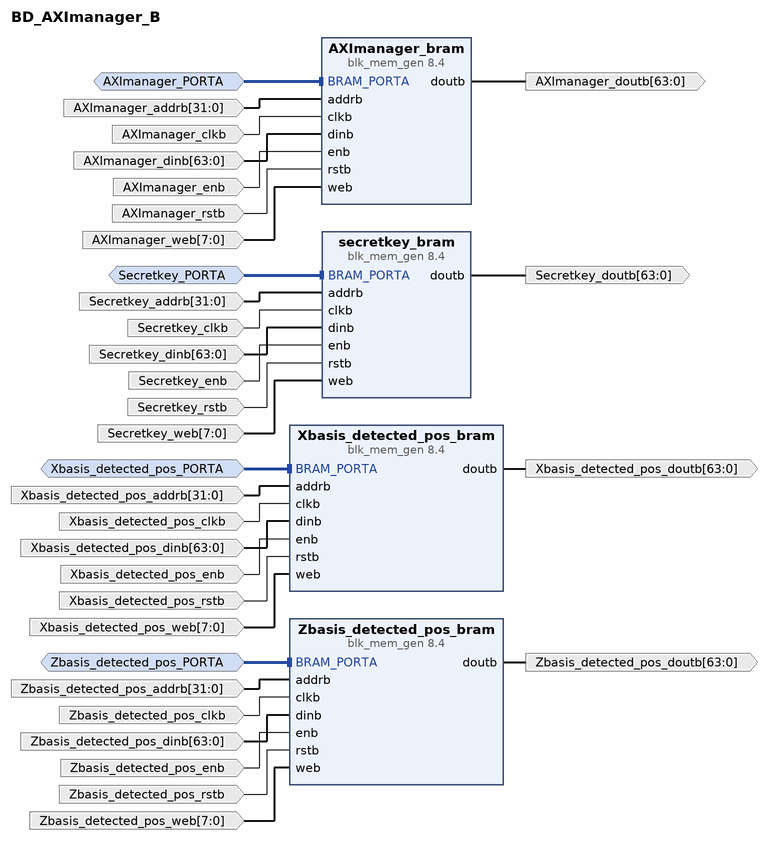
[diagram p0: block diagram of the top level]
# Vivado block design BD_AXImanager_B, xcku5p-ffvb676-2-e, Vivado 2022.1
create_bd_design BD_AXImanager_B

create_bd_intf_port -mode Slave -vlnv xilinx.com:interface:bram_rtl:1.0 AXImanager_PORTA
set_property -dict [list \
  CONFIG.MASTER_TYPE BRAM_CTRL \
  CONFIG.MEM_SIZE 4096 \
  CONFIG.MEM_WIDTH 64 \
  CONFIG.READ_WRITE_MODE READ_WRITE \
] [get_bd_intf_ports AXImanager_PORTA]
create_bd_intf_port -mode Slave -vlnv xilinx.com:interface:bram_rtl:1.0 Secretkey_PORTA
set_property -dict [list \
  CONFIG.MASTER_TYPE BRAM_CTRL \
  CONFIG.MEM_SIZE 262144 \
  CONFIG.MEM_WIDTH 64 \
  CONFIG.READ_WRITE_MODE READ_WRITE \
] [get_bd_intf_ports Secretkey_PORTA]
create_bd_intf_port -mode Slave -vlnv xilinx.com:interface:bram_rtl:1.0 Xbasis_detected_pos_PORTA
set_property -dict [list \
  CONFIG.MASTER_TYPE BRAM_CTRL \
  CONFIG.MEM_SIZE 262144 \
  CONFIG.MEM_WIDTH 64 \
  CONFIG.READ_WRITE_MODE READ_WRITE \
] [get_bd_intf_ports Xbasis_detected_pos_PORTA]
create_bd_intf_port -mode Slave -vlnv xilinx.com:interface:bram_rtl:1.0 Zbasis_detected_pos_PORTA
set_property -dict [list \
  CONFIG.MASTER_TYPE BRAM_CTRL \
  CONFIG.MEM_SIZE 262144 \
  CONFIG.MEM_WIDTH 64 \
  CONFIG.READ_WRITE_MODE READ_WRITE \
] [get_bd_intf_ports Zbasis_detected_pos_PORTA]
create_bd_port -dir I -from 31 -to 0 AXImanager_addrb
create_bd_port -dir I -type clk AXImanager_clkb
create_bd_port -dir I -from 63 -to 0 AXImanager_dinb
create_bd_port -dir O -from 63 -to 0 AXImanager_doutb
create_bd_port -dir I AXImanager_enb
create_bd_port -dir I -type rst AXImanager_rstb
create_bd_port -dir I -from 7 -to 0 AXImanager_web
create_bd_port -dir I -type rst Xbasis_detected_pos_rstb
create_bd_port -dir O -from 63 -to 0 Xbasis_detected_pos_doutb
create_bd_port -dir I Xbasis_detected_pos_enb
create_bd_port -dir I -type clk Xbasis_detected_pos_clkb
set_property -dict {CONFIG.FREQ_HZ 125000000} [get_bd_ports Xbasis_detected_pos_clkb]
create_bd_port -dir I -from 63 -to 0 Xbasis_detected_pos_dinb
create_bd_port -dir I -from 31 -to 0 Xbasis_detected_pos_addrb
create_bd_port -dir I -from 7 -to 0 Xbasis_detected_pos_web
create_bd_port -dir I -from 31 -to 0 Zbasis_detected_pos_addrb
create_bd_port -dir I -type clk Zbasis_detected_pos_clkb
set_property -dict {CONFIG.FREQ_HZ 125000000} [get_bd_ports Zbasis_detected_pos_clkb]
create_bd_port -dir I -from 63 -to 0 Zbasis_detected_pos_dinb
create_bd_port -dir O -from 63 -to 0 Zbasis_detected_pos_doutb
create_bd_port -dir I Zbasis_detected_pos_enb
create_bd_port -dir I -type rst Zbasis_detected_pos_rstb
create_bd_port -dir I -from 7 -to 0 Zbasis_detected_pos_web
create_bd_port -dir I -from 31 -to 0 Secretkey_addrb
create_bd_port -dir I -from 63 -to 0 Secretkey_dinb
create_bd_port -dir I -type clk Secretkey_clkb
create_bd_port -dir I Secretkey_enb
create_bd_port -dir O -from 63 -to 0 Secretkey_doutb
create_bd_port -dir I -type rst Secretkey_rstb
create_bd_port -dir I -from 7 -to 0 Secretkey_web

create_bd_cell -type ip -vlnv xilinx.com:ip:blk_mem_gen:8.4 Zbasis_detected_pos_bram
set_property -dict {CONFIG.Memory_Type True_Dual_Port_RAM} [get_bd_cells Zbasis_detected_pos_bram]
create_bd_cell -type ip -vlnv xilinx.com:ip:blk_mem_gen:8.4 Xbasis_detected_pos_bram
set_property -dict {CONFIG.Memory_Type True_Dual_Port_RAM} [get_bd_cells Xbasis_detected_pos_bram]
create_bd_cell -type ip -vlnv xilinx.com:ip:blk_mem_gen:8.4 secretkey_bram
set_property -dict {CONFIG.Memory_Type True_Dual_Port_RAM} [get_bd_cells secretkey_bram]
create_bd_cell -type ip -vlnv xilinx.com:ip:blk_mem_gen:8.4 AXImanager_bram
set_property -dict [list \
  CONFIG.Enable_B Use_ENB_Pin \
  CONFIG.Memory_Type True_Dual_Port_RAM \
  CONFIG.Port_B_Clock 100 \
  CONFIG.Port_B_Enable_Rate 100 \
  CONFIG.Port_B_Write_Rate 50 \
  CONFIG.Use_RSTB_Pin true \
] [get_bd_cells AXImanager_bram]

# ---- connections ----

connect_bd_intf_net -intf_net BRAM_PORTA_0_1 [get_bd_intf_ports AXImanager_PORTA] [get_bd_intf_pins AXImanager_bram/BRAM_PORTA]
connect_bd_intf_net -intf_net BRAM_PORTA_0_2 [get_bd_intf_ports Secretkey_PORTA] [get_bd_intf_pins secretkey_bram/BRAM_PORTA]
connect_bd_intf_net -intf_net BRAM_PORTA_0_3 [get_bd_intf_ports Xbasis_detected_pos_PORTA] [get_bd_intf_pins Xbasis_detected_pos_bram/BRAM_PORTA]
connect_bd_intf_net -intf_net BRAM_PORTA_0_4 [get_bd_intf_ports Zbasis_detected_pos_PORTA] [get_bd_intf_pins Zbasis_detected_pos_bram/BRAM_PORTA]
connect_bd_net [get_bd_pins AXImanager_bram/doutb] [get_bd_ports AXImanager_doutb]
connect_bd_net -net EV_randombit_bram_doutb [get_bd_pins Xbasis_detected_pos_bram/doutb] [get_bd_ports Xbasis_detected_pos_doutb]
connect_bd_net -net addrb_0_1 [get_bd_ports AXImanager_addrb] [get_bd_pins AXImanager_bram/addrb]
connect_bd_net -net addrb_0_3 [get_bd_ports Xbasis_detected_pos_addrb] [get_bd_pins Xbasis_detected_pos_bram/addrb]
connect_bd_net -net addrb_0_4 [get_bd_ports Zbasis_detected_pos_addrb] [get_bd_pins Zbasis_detected_pos_bram/addrb]
connect_bd_net -net addrb_0_5 [get_bd_ports Secretkey_addrb] [get_bd_pins secretkey_bram/addrb]
connect_bd_net -net clkb_0_1 [get_bd_ports AXImanager_clkb] [get_bd_pins AXImanager_bram/clkb]
connect_bd_net -net clkb_0_3 [get_bd_ports Xbasis_detected_pos_clkb] [get_bd_pins Xbasis_detected_pos_bram/clkb]
connect_bd_net -net clkb_0_4 [get_bd_ports Zbasis_detected_pos_clkb] [get_bd_pins Zbasis_detected_pos_bram/clkb]
connect_bd_net -net clkb_0_5 [get_bd_ports Secretkey_clkb] [get_bd_pins secretkey_bram/clkb]
connect_bd_net -net dinb_0_1 [get_bd_ports AXImanager_dinb] [get_bd_pins AXImanager_bram/dinb]
connect_bd_net -net dinb_0_3 [get_bd_ports Xbasis_detected_pos_dinb] [get_bd_pins Xbasis_detected_pos_bram/dinb]
connect_bd_net -net dinb_0_4 [get_bd_ports Zbasis_detected_pos_dinb] [get_bd_pins Zbasis_detected_pos_bram/dinb]
connect_bd_net -net dinb_0_5 [get_bd_ports Secretkey_dinb] [get_bd_pins secretkey_bram/dinb]
connect_bd_net -net enb_0_1 [get_bd_ports AXImanager_enb] [get_bd_pins AXImanager_bram/enb]
connect_bd_net -net enb_0_3 [get_bd_ports Xbasis_detected_pos_enb] [get_bd_pins Xbasis_detected_pos_bram/enb]
connect_bd_net -net enb_0_4 [get_bd_ports Zbasis_detected_pos_enb] [get_bd_pins Zbasis_detected_pos_bram/enb]
connect_bd_net -net enb_0_5 [get_bd_ports Secretkey_enb] [get_bd_pins secretkey_bram/enb]
connect_bd_net -net qubit_bram_doutb [get_bd_pins Zbasis_detected_pos_bram/doutb] [get_bd_ports Zbasis_detected_pos_doutb]
connect_bd_net -net rstb_0_1 [get_bd_ports AXImanager_rstb] [get_bd_pins AXImanager_bram/rstb]
connect_bd_net -net rstb_0_3 [get_bd_ports Xbasis_detected_pos_rstb] [get_bd_pins Xbasis_detected_pos_bram/rstb]
connect_bd_net -net rstb_0_4 [get_bd_ports Zbasis_detected_pos_rstb] [get_bd_pins Zbasis_detected_pos_bram/rstb]
connect_bd_net -net rstb_0_5 [get_bd_ports Secretkey_rstb] [get_bd_pins secretkey_bram/rstb]
connect_bd_net [get_bd_pins secretkey_bram/doutb] [get_bd_ports Secretkey_doutb]
connect_bd_net -net web_0_1 [get_bd_ports AXImanager_web] [get_bd_pins AXImanager_bram/web]
connect_bd_net -net web_0_3 [get_bd_ports Xbasis_detected_pos_web] [get_bd_pins Xbasis_detected_pos_bram/web]
connect_bd_net -net web_0_4 [get_bd_ports Zbasis_detected_pos_web] [get_bd_pins Zbasis_detected_pos_bram/web]
connect_bd_net -net web_0_5 [get_bd_ports Secretkey_web] [get_bd_pins secretkey_bram/web]

validate_bd_design
save_bd_design
